# Altium schematic sheet 05021002_Input's.SchDoc: Ipê Board
size A4; Organization: Cerebra SC; Address1: R. Coriolano José Gilbertone; Address2: Jd. Paulista; Address3: n° 703; Address4: São Carlos - Brasil; DocumentNumber: 2; Revision: A; SheetNumber: 2; SheetTotal: 8
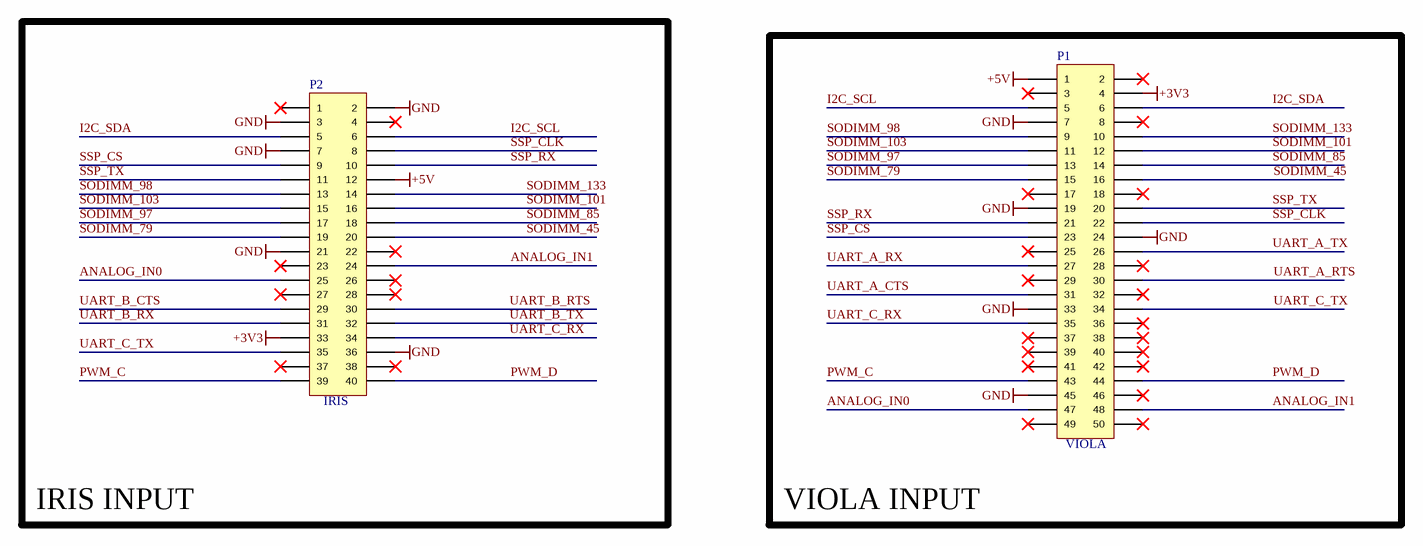
[diagram p0: 05021002_Input's.SchDoc]

## Parts
P1  VIOLA  [HDR2X25]
P2  IRIS  [HDR2X20]

## Blocks framed on the sheet
IRIS INPUT: P2
VIOLA INPUT: P1

## Nets
+3V3: P1.4 P2.33
+5V: P1.1 P2.12
GND: P1.7 P1.19 P1.24 P1.33 P1.45 P2.2 P2.3 P2.7 P2.21 P2.36
ANALOG_IN0: P1.47 P2.25
ANALOG_IN1: P1.48 P2.24
I2C_SCL: P1.5 P2.6
I2C_SDA: P1.6 P2.5
PWM_C: P1.43 P2.39
PWM_D: P1.44 P2.40
SODIMM_45: P1.16 P2.20
SODIMM_79: P1.15 P2.19
SODIMM_85: P1.14 P2.18
SODIMM_97: P1.13 P2.17
SODIMM_98: P1.9 P2.13
SODIMM_101: P1.12 P2.16
SODIMM_103: P1.11 P2.15
SODIMM_133: P1.10 P2.14
SSP_CLK: P1.22 P2.8
SSP_CS: P1.23 P2.9
SSP_RX: P1.21 P2.10
SSP_TX: P1.20 P2.11
UART_A_CTS: P1.31
UART_A_RTS: P1.30
UART_A_RX: P1.27
UART_A_TX: P1.26
UART_B_CTS: P2.29
UART_B_RTS: P2.30
UART_B_RX: P2.31
UART_B_TX: P2.32
UART_C_RX: P1.35 P2.34
UART_C_TX: P1.34 P2.35

Not connected (* = marked no-connect by the designer): P1 2* 3* 8* 17* 18* 25* 28* 29* 32* 36* 37* 38* 39* 40* 41* 42* 46* 49* 50*; P2 1* 4* 22* 23* 26* 27* 28* 37* 38*

## Notes on the sheet
- Title
- Size:
- Date:
- A4
- Number:
- Time:
- Revision:
- Sheet
- of
- File:

## Library data of the parts
P1 = Header 25X2: Header, 25-Pin, Dual row; LatestRevisionDate: 17-Jul-2002; LatestRevisionNote: Re-released for DXP Platform.; Publisher: Altium Limited
P2 = Header 20X2: Header, 20-Pin, Dual row; LatestRevisionDate: 17-Jul-2002; LatestRevisionNote: Re-released for DXP Platform.; Publisher: Altium Limited